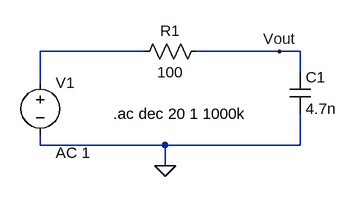
[diagram p0: schematic RC_Low_Pass.asc]
RC_Low_Pass.asc, the LTspice schematic file:
Version 4.1
SHEET 1 880 680
WIRE 240 64 80 64
WIRE 448 64 320 64
WIRE 480 64 448 64
WIRE 480 96 480 64
WIRE 80 112 80 64
WIRE 80 208 80 192
WIRE 272 208 80 208
WIRE 480 208 480 160
WIRE 480 208 272 208
WIRE 272 240 272 208
FLAG 272 240 0
FLAG 448 64 Vout
SYMBOL voltage 80 96 R0
WINDOW 123 24 124 Left 2
WINDOW 39 0 0 Left 0
SYMATTR Value2 AC 1
SYMATTR InstName V1
SYMATTR Value ""
SYMBOL res 336 48 R90
WINDOW 0 0 56 VBottom 2
WINDOW 3 32 56 VTop 2
SYMATTR InstName R1
SYMATTR Value 100
SYMBOL cap 464 96 R0
SYMATTR InstName C1
SYMATTR Value 4.7n
TEXT 192 160 Left 2 !.ac dec 20 1 1000k

The netlist it stands for:
* RC_Low_Pass.asc
V1 N001 0 AC 1
R1 Vout N001 100
C1 Vout 0 4.7n
.ac dec 20 1 1000k
.backanno
.end

* Results of the author's LTspice run, read from the files saved beside the schematic
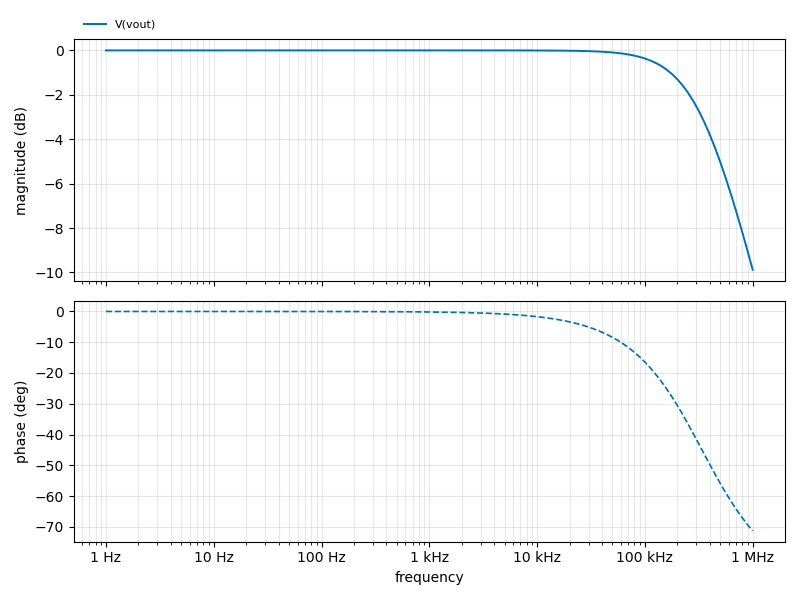
[diagram p1: AC Analysis of RC_Low_Pass.asc, plotted from the saved traces]
* AC Analysis, 1 run:
*   V(vout): -0.00 dB at 1 Hz, -9.88 dB at 1 MHz, peak -0.00 dB at 1 Hz, 3 dB below the peak at 338.1 kHz